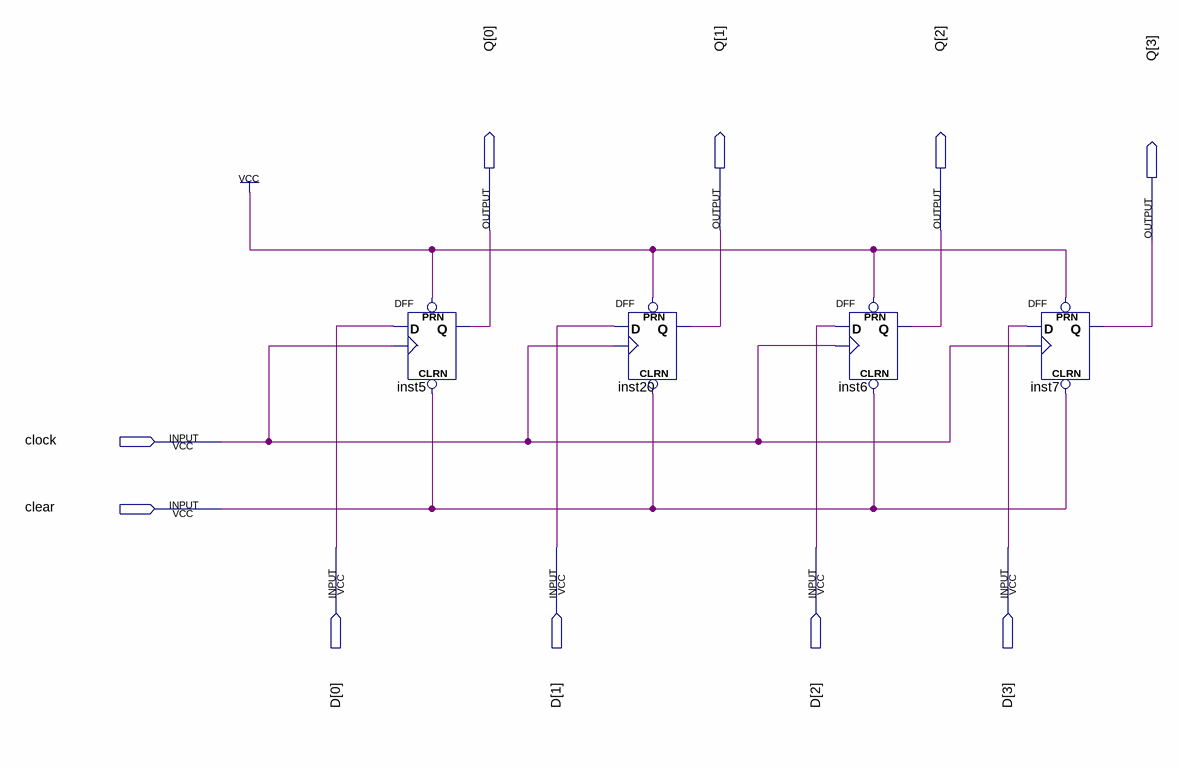
[diagram p0: schematic sheet]
// Quartus schematic register.bdf as structural Verilog: 4 symbols, 10 pins
module register (
  input  clock,
  input  clear,
  input  [3:0] D,
  output [3:0] Q
);

  DFF inst5 (.CLRN(clear), .CLK(clock), .D(D[0]), .PRN(1'b1), .Q(Q[0]));
  DFF inst20 (.CLRN(clear), .CLK(clock), .D(D[1]), .PRN(1'b1), .Q(Q[1]));
  DFF inst6 (.CLRN(clear), .CLK(clock), .D(D[2]), .PRN(1'b1), .Q(Q[2]));
  DFF inst7 (.CLRN(clear), .CLK(clock), .D(D[3]), .PRN(1'b1), .Q(Q[3]));
endmodule
